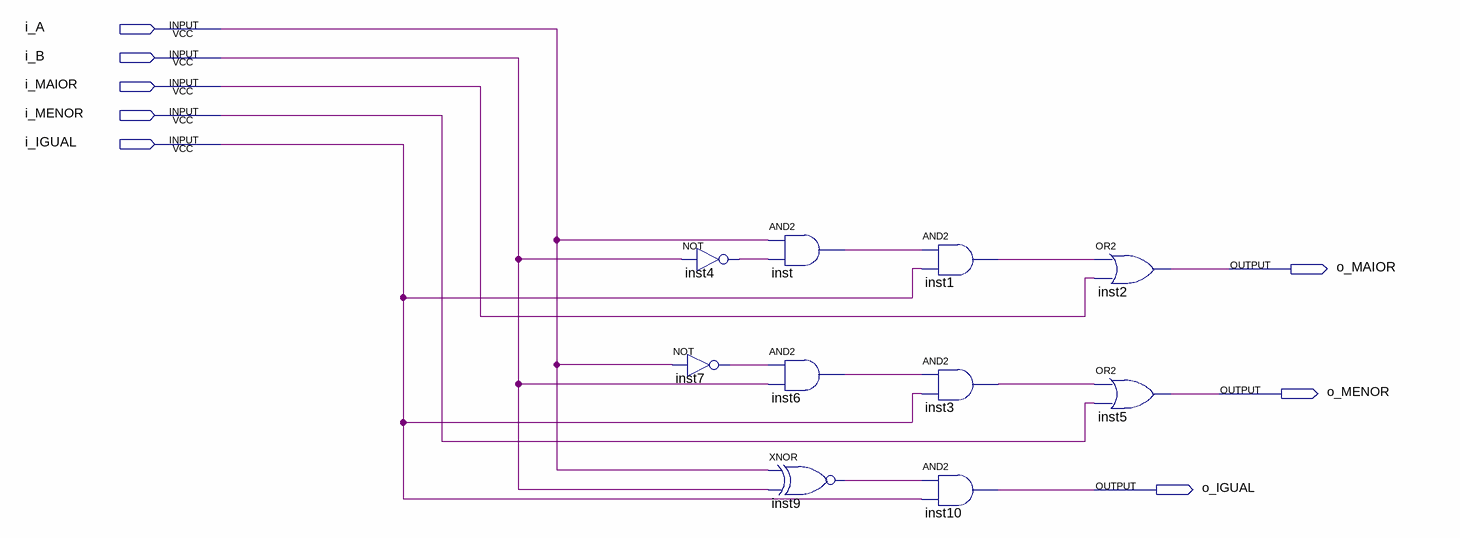
[diagram p0: schematic sheet]
// Quartus schematic magnitude1b.bdf as structural Verilog: 10 symbols, 8 pins
module magnitude1b (
  input  i_A,
  input  i_B,
  input  i_MAIOR,
  input  i_MENOR,
  input  i_IGUAL,
  output o_MAIOR,
  output o_MENOR,
  output o_IGUAL
);

  wire inst1_out, inst3_out, inst4_out, inst6_out, inst7_out, inst9_out, inst_out;

  not inst4 (inst4_out, i_B);
  not inst7 (inst7_out, i_A);
  and inst (inst_out, i_A, inst4_out);
  and inst6 (inst6_out, inst7_out, i_B);
  xnor inst9 (inst9_out, i_A, i_B);
  and inst1 (inst1_out, inst_out, i_IGUAL);
  and inst3 (inst3_out, inst6_out, i_IGUAL);
  and inst10 (o_IGUAL, inst9_out, i_IGUAL);
  or inst2 (o_MAIOR, inst1_out, i_MAIOR);
  or inst5 (o_MENOR, inst3_out, i_MENOR);
endmodule
